# Altium schematic sheet ADO_Borad.SchDoc
size A; SheetNumber: 1; SheetTotal: 1
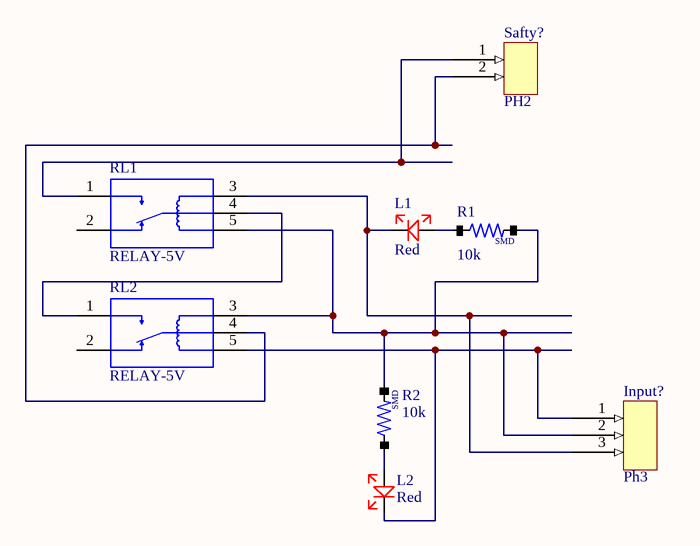
[diagram p0: ADO_Borad.SchDoc]

## Parts
Input?  Ph3  [CONECTOR/FONIX/3PIN]
L1  Red  [led/3MM/DIP]
L2  Red  [led/3MM/DIP]
R1  10k  [RES/1206]
R2  10k  [RES/1206]
RL1  RELAY-5V  [RELAY-5V]
RL2  RELAY-5V  [RELAY-5V]
Safty?  PH2  [CONECTOR/FONIX/2PIN]

## Nets
NetInput?_1: Input?.1 L2.K RL2.5(C2)
NetInput?_2: Input?.2 R1.2 R2.2 RL1.5(C2) RL2.3(C1)
NetInput?_3: Input?.3 L1.K RL1.3(C1)
NetL1_A: L1.A R1.1
NetL2_A: L2.A R2.1
NetRL1_1: RL1.1(NO) Safty?.1
NetRL1_4: RL1.4(C) RL2.1(NO)
NetRL2_4: RL2.4(C) Safty?.2

Not connected (* = marked no-connect by the designer): RL1 2(NC); RL2 2(NC)

## Notes on the sheet
- (in symbol RES/SMD) SMD

## Library data of the parts
Input? = CONECTOR/FONIX/3PIN
L1 L2 = LED-1COLER
R1 R2 = RES/SMD
Safty? = CONECTOR/FONIX/2PIN